# EAGLE design SerialUPDI Programmer (EAGLE 7.6.0)
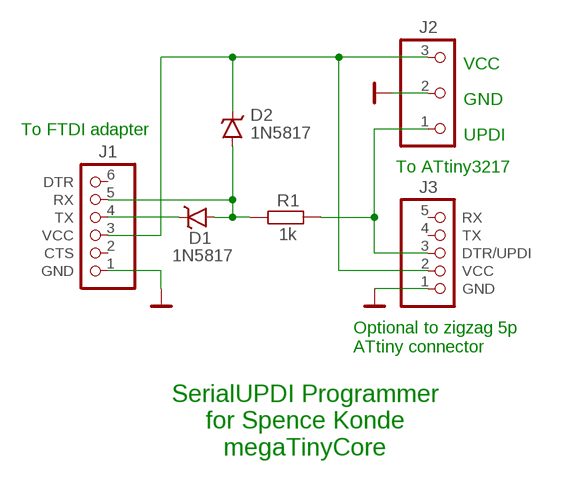
[diagram p0: schematic, sheet 1]

## Parts
D1  1N5817  SCHOTTKY-SMD-SOD523  [SOD523]
D2  1N5817  SCHOTTKY-SMD-SOD523  [SOD523]
J1  6P  FTDIHEADER  [1X06]
J2  nc  CON-3P2.54  [1X03]
J3  nc  ZIGZAG-FTDI-UPDI-5P"  [FTDI-UPDI-5P]
R1  1k  SMD-R0603  [0603]

## Nets
5V: D2.C J1.3(VCC) J2.3 J3.2(VCC)
GND: J1.1(GND) J2.2 J3.1(GND)
N$1: D1.A D2.A J1.5(RX) R1.1
N$2: D1.C J1.4(TX)
UPDI: J2.1 J3.3(DTR/UPDI) R1.2
Unconnected: J1.2(CTS) J1.6(DTR) J3.4(TX) J3.5(RX)

## Notes on the sheet
- VCC
- GND
- UPDI
- To FTDI adapter
- To ATtiny3217
- Optional to zigzag 5p 
  ATtiny connector
- SerialUPDI Programmer
  for Spence Konde
  megaTinyCore

## Library data of the parts
D1 D2 = Albert:SCHOTTKY-SMD
J1 = Albert:FTDI
J2 = Albert:CON-3P
J3 = Albert:ZIGZAG-FTDI-UPDI-5P
R1 = Albert:SMD-R: Resistor

## Board
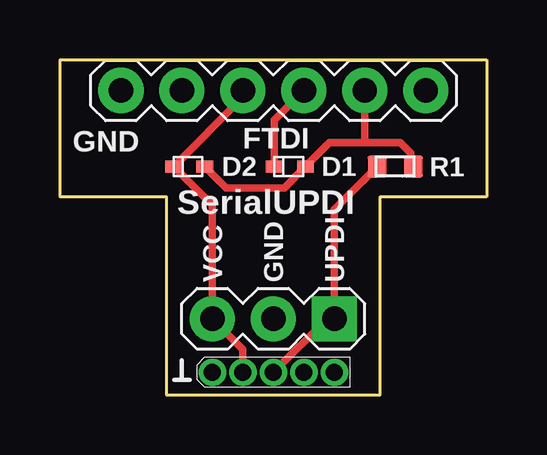
[diagram p1: board, top side]
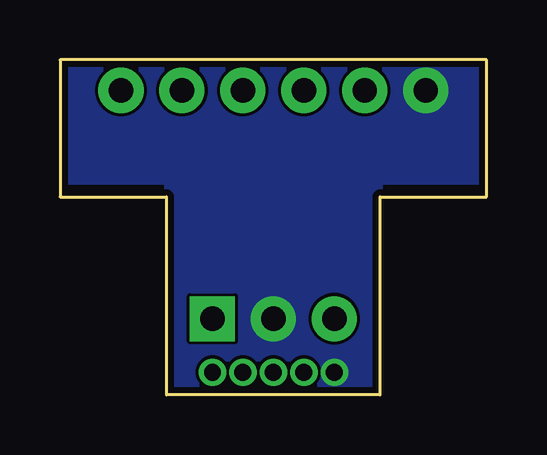
[diagram p2: board, bottom side, seen from below]

Size 17.78 x 13.97 mm. Coordinates in mm from the lower left corner, seen from the top.
Outline: 4.45,0 13.34,0 13.34,8.26 17.78,8.26 17.78,13.97 0,13.97 0,8.26 4.45,8.26 4.45,0
Copper layers (1*16): Top 0.035mm / dielectric 1.5mm / Bottom 0.035mm
Design rules "Albert 5mil": minimum track width 5mil, minimum drill 0.3mm, track to track 5mil, track to pad 5mil, pad to pad 5mil, via to via 5mil, smd to smd 5mil, copper to edge 10mil, drill to drill 8mil, minimum pad ring 8.5mil, minimum via ring 6mil, stop-mask expansion 4mil, vias tented up to drill 25mil, thermal gap 10mil

### Footprints (pad centres in the part's own frame; a part is rotated, then mirrored left to right if it is on the bottom)
SOD523 = smd 0.7 x 0.5: A 0.7,0; C -0.6,0
1X06 = drill 1.016 pad 1.88: 1 0,0; 2 2.54,0; 3 5.08,0; 4 7.62,0; 5 10.16,0; 6 12.7,0
1X03 = drill 1.016 pad 1.88 square: 1 0,0 | drill 1.016 pad 1.88: 2 2.54,0; 3 5.08,0
FTDI-UPDI-5P = drill 0.7 pad 1.143: 1 0,0; 2 1.27,0; 3 2.54,0; 4 3.81,0; 5 5.08,0
0603 = smd 0.9 x 0.8: 1 0,0.75; 2 0,-0.75

### Placement (x,y rotation side)
D1  9.53,9.53 0 top
D2  5.33,9.53 0 top
J1  2.54,12.7 0 top
J2  11.43,3.17 180 top
J3  6.35,0.94 0 top
R1  13.97,9.53 270 top

### Tracks (layer width: path | path; a pad name or v marks a point on that pad's centre or on a via)
5V
  Top 0.305: J3.2 7.62,1.91 J2.3 6.35,7.91 D2.C | D2.C 4.95,9.53 | J1.3 7.62,12.41 D2.C
GND
  pour Bottom (no thermals): 0,13.97 17.78,13.97 17.78,8.89 13.34,8.89 13.34,0 4.45,0 4.45,8.89 0,8.89
N$1
  Top 0.305: R1.1 14.61,9.53 14.61,10.08 14.17,10.52 12.65,10.52 | D2.A 6.92,8.64 7.37,8.64 9.34,8.64 D1.A 11.22,10.52 12.65,10.52 | J1.5 12.7,10.57 12.65,10.52
N$2
  Top 0.305: D1.C 8.93,11.46 J1.4
UPDI
  Top 0.305: R1.2 11.43,7.74 J2.1 11.12,3.17 J3.3

### Text on the board
tNames: GND | FTDI | SerialUPDI | VCC | GND | UPDI